# EAGLE design Modified-Pro-Mini (EAGLE 8.3.2)
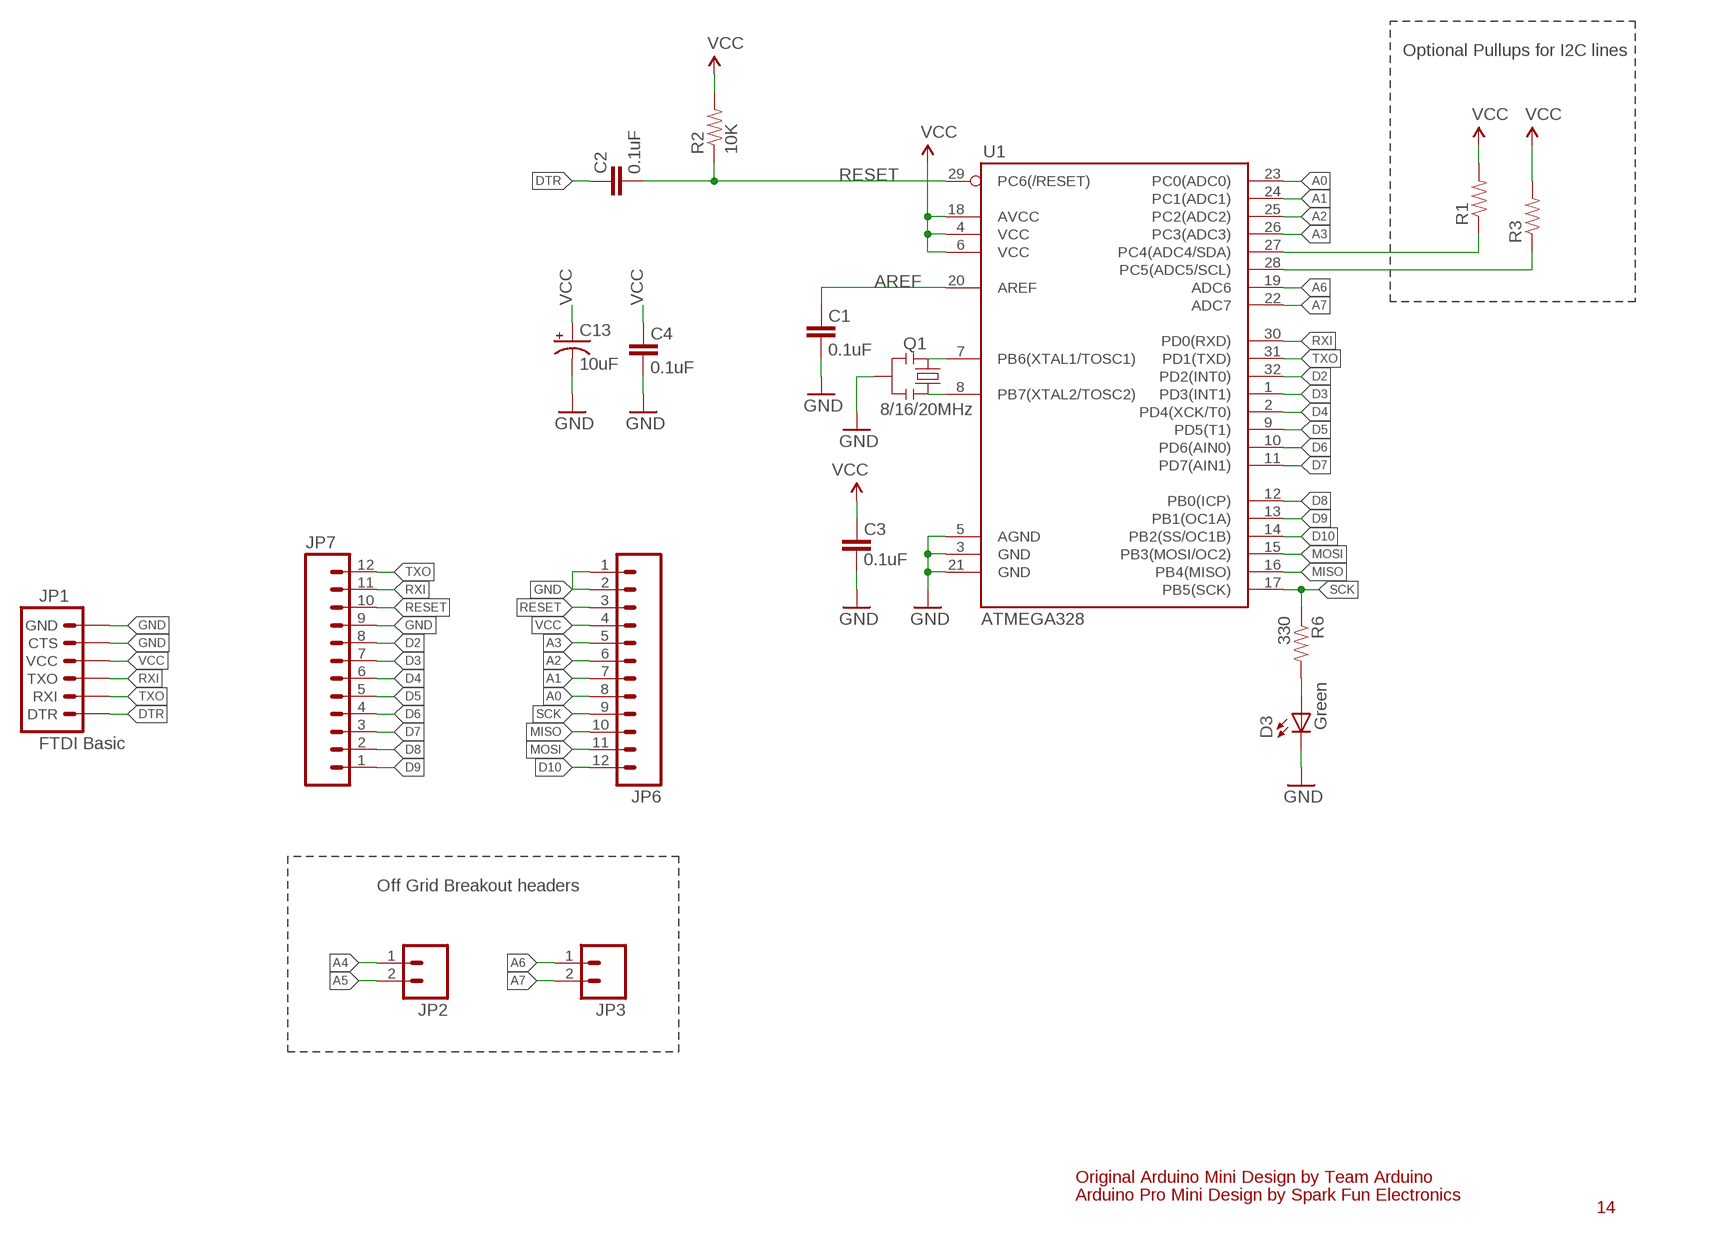
[diagram p0: schematic, sheet 1]

## Parts
C1  0.1uF  CAP0603-CAP  [0603-CAP]
C2  0.1uF  CAP0603-CAP  [0603-CAP]
C3  0.1uF  CAP0603-CAP  [0603-CAP]
C4  0.1uF  CAP0603-CAP  [0603-CAP]
C13  10uF  CAP_POL1206  [EIA3216]
D3  Green  LED  [0603-LED-ALT1]
JP1  FTDI Basic  ARDUINO_SERIAL_PROGRAMPTH  [1X06]
JP2  M02PTH  [1X02]
JP3  M02PTH  [1X02]
JP6  M12PTH  [1X12]
JP7  M12PTH  [1X12]
Q1  8/16/20MHz  RESONATOR1:1  [RESONATOR-SMD-1:1]
R1  RESISTOR0603-RES  [0603-RES]
R2  10K  RESISTOR0603-RES  [0603-RES]
R3  RESISTOR0603-RES  [0603-RES]
R6  330  RESISTOR0603-RES  [0603-RES]
U1  ATMEGA328  ATMEGA168  [TQFP32-08]

## Nets
A0: JP6.8 U1.23(PC0(ADC0))
A1: JP6.7 U1.24(PC1(ADC1))
A2: JP6.6 U1.25(PC2(ADC2))
A3: JP6.5 U1.26(PC3(ADC3))
A4: JP2.1 R1.1 U1.27(PC4(ADC4/SDA))
A5: JP2.2 R3.1 U1.28(PC5(ADC5/SCL))
A6: JP3.1 U1.19(ADC6)
A7: JP3.2 U1.22(ADC7)
AREF: C1.2 U1.20(AREF)
D2: JP7.8 U1.32(PD2(INT0))
D3: JP7.7 U1.1(PD3(INT1))
D4: JP7.6 U1.2(PD4(XCK/T0))
D5: JP7.5 U1.9(PD5(T1))
D6: JP7.4 U1.10(PD6(AIN0))
D7: JP7.3 U1.11(PD7(AIN1))
D8: JP7.2 U1.12(PB0(ICP))
D9: JP7.1 U1.13(PB1(OC1A))
D10: JP6.12 U1.14(PB2(SS/OC1B))
DTR: C2.2 JP1.1(DTR)
GND [vcc]: C1.1 C3.1 C4.1 C13.C(-) D3.C JP1.5(CTS) JP1.6(GND) JP6.1 JP6.2 JP7.9 Q1.2 U1.3(GND) U1.5(AGND) U1.21(GND)
MISO: JP6.10 U1.16(PB4(MISO))
MOSI: JP6.11 U1.15(PB3(MOSI/OC2))
N$1: Q1.3 U1.8(PB7(XTAL2/TOSC2))
N$2: Q1.1 U1.7(PB6(XTAL1/TOSC1))
N$7: D3.A R6.2
RESET: C2.1 JP6.3 JP7.10 R2.1 U1.29(PC6(/RESET))
RXI: JP1.3(TXO) JP7.11 U1.30(PD0(RXD))
SCK: JP6.9 R6.1 U1.17(PB5(SCK))
TXO: JP1.2(RXI) JP7.12 U1.31(PD1(TXD))
VCC: C3.2 C4.2 C13.A(+) JP1.4(VCC) JP6.4 R1.2 R2.2 R3.2 U1.4(VCC) U1.6(VCC) U1.18(AVCC)

## Notes on the sheet
- Optional Pullups for I2C lines
- Off Grid Breakout headers
- Original Arduino Mini Design by Team Arduino
- Arduino Pro Mini Design by Spark Fun Electronics
- 14

## Library data of the parts
C1-C4 = SparkFun:CAP: Capacitor Standard 0603 ceramic capacitor, and 0.1" leaded capacitor.
C13 = SparkFun:CAP_POL: Capacitor Polarized These are standard SMD and PTH capacitors. Normally 10uF, 47uF, and 100uF in electrolytic and tantalum varieties. Always verify the external diameter of the through hole cap, it varies with capacity, voltage, and manufacturer. The EIA devices should be standard.
D3 = Testing:LED: LEDs Standard schematic elements and footprints for 5mm, 3mm, 1206, and 0603 sized LEDs. 5mm - Spark Fun Electronics SKU : COM-00529 (and others)
JP1 = SparkFun:ARDUINO_SERIAL_PROGRAM
JP2 JP3 = SparkFun:M02: Header 2 Standard 2-pin 0.1" header. Use with straight break away headers (SKU : PRT-00116), right angle break away headers (PRT-00553), swiss pins (PRT-00743), machine pins (PRT-00117), and female headers (PRT-00115). Molex polarized connector foot print use with SKU : PRT-08233 with associated crimp pins and housings.
JP6 JP7 = SparkFun:M12: Header 12 Standard 12-pin 0.1" header. Use with straight break away headers (SKU : PRT-00116), right angle break away headers (PRT-00553), swiss pins (PRT-00743), machine pins (PRT-00117), and female headers (PRT-00115).
Q1 = Testing:RESONATOR: Resonator Small SMD resonator. This is the itty bitty 10/20MHz resonators with built in caps. CSTCE10M0G55 and CSTCE20M0V53. Footprint for SMD has been used in SFE production for years, and does work okay. 1:1 is an attempt to get larger fillets on the sides so it will be easier to inspect these solders in our AOI machine. The pads have been minimized to match the actual metal under the resonator. To see this relation, it includes an image import of the bottom side of the component. Imported to scale on layer 200.
R1-R3 R6 = SparkFun:RESISTOR: Resistor Basic schematic elements and footprints for 0603, 1206, and PTH resistors.
U1 = SparkFun:ATMEGA168

## Net classes
0 default: width 0.203 mm
1 vcc: width 0.254 mm

## Board
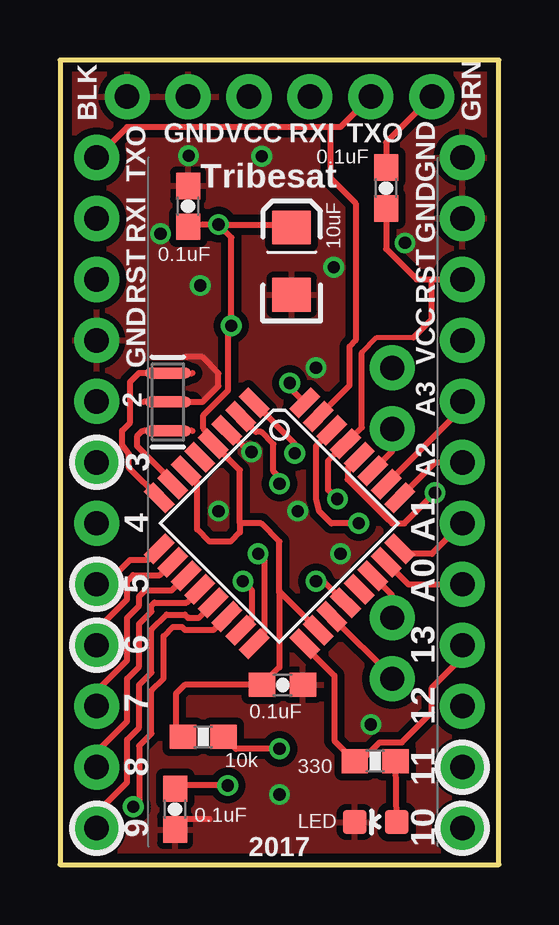
[diagram p1: board, top side]
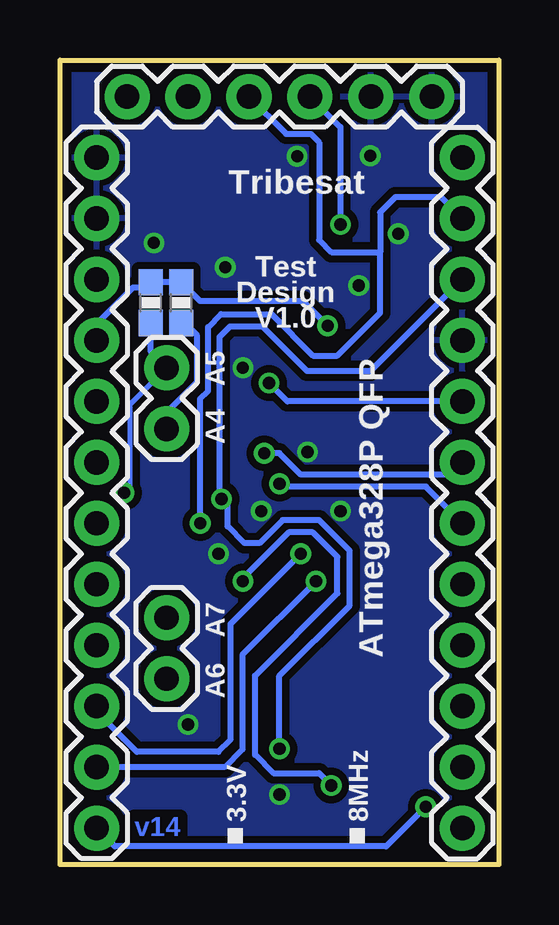
[diagram p2: board, bottom side, seen from below]

Size 18.29 x 33.53 mm. Coordinates in mm from the lower left corner, seen from the top.
Outline: 0,33.53 0,0 18.29,0 18.29,33.53 0,33.53
Copper layers (1*16): Top 0.0356mm / dielectric 1.5011mm / Bottom 0.0356mm
Design rules "oshpark-2layer": minimum track width 6mil, minimum drill 13mil, track to track 6mil, track to pad 6mil, pad to pad 6mil, via to via 6mil, smd to smd 6mil, copper to edge 15mil, drill to drill 6mil, minimum pad ring 7mil, minimum via ring 7mil, stop-mask expansion 2.5mil, vias tented up to drill 0mil, thermal gap 10mil

### Footprints (pad centres in the part's own frame; a part is rotated, then mirrored left to right if it is on the bottom)
0603-CAP = smd 1.1 x 1: 1 -0.85,0; 2 0.85,0
EIA3216 = smd 1.4 x 1.6: A 1.4,0; C -1.4,0
0603-LED-ALT1 = smd 1 x 1: A 0,-0.877; C 0,0.877
1X06 = drill 1.016 pad 1.88: 1 0,0; 2 2.54,0; 3 5.08,0; 4 7.62,0; 5 10.16,0; 6 12.7,0
1X02 = drill 1.016 pad 1.88: 1 0,0; 2 2.54,0
1X12 = drill 1.016 pad 1.88: 1 0,0; 2 2.54,0; 3 5.08,0; 4 7.62,0; 5 10.16,0; 6 12.7,0; 7 15.24,0; 8 17.78,0; 9 20.32,0; 10 22.86,0; 11 25.4,0; 12 27.94,0
RESONATOR-SMD-1:1 = smd 0.45 x 1.905: 1 -1.2,0; 2 0,0; 3 1.2,0
0603-RES = smd 1.1 x 1: 1 -0.85,0; 2 0.85,0
TQFP32-08 = smd 1.27 x 0.559: 1 -4.293,2.8; 2 -4.293,2; 3 -4.293,1.2; 4 -4.293,0.4; 5 -4.293,-0.4; 6 -4.293,-1.2; 7 -4.293,-2; 8 -4.293,-2.8; 17 4.293,-2.8; 18 4.293,-2; 19 4.293,-1.2; 20 4.293,-0.4; 21 4.293,0.4; 22 4.293,1.2; 23 4.293,2; 24 4.293,2.8 | smd 0.559 x 1.27: 9 -2.8,-4.293; 10 -2,-4.293; 11 -1.2,-4.293; 12 -0.4,-4.293; 13 0.4,-4.293; 14 1.2,-4.293; 15 2,-4.293; 16 2.8,-4.293; 25 2.8,4.293; 26 2,4.293; 27 1.2,4.293; 28 0.4,4.293; 29 -0.4,4.293; 30 -1.2,4.293; 31 -2,4.293; 32 -2.8,4.293

### Placement (x,y rotation side)
C1  4.8,2.31 90 top
C2  13.59,28.19 90 top
C3  9.27,7.49 180 top
C4  5.33,27.43 270 top
C13  9.65,25.15 90 top
D3  13.16,1.78 90 top
JP1  15.49,32 0 bottom
JP2  13.84,18.16 90 bottom
JP3  13.84,7.75 90 bottom
JP6  16.76,29.46 270 bottom
JP7  1.52,1.52 90 bottom
Q1  4.5,19.28 90 top
R1  13.23,23.42 90 bottom
R2  5.97,5.33 180 top
R3  14.5,23.42 90 bottom
R6  13.13,4.32 0 top
U1  9.14,14.22 315 top

### Tracks (layer width: path | path; a pad name or v marks a point on that pad's centre or on a via)
A0
  Top 0.254: 14.51,11.68 JP6.8 | U1.23 14.51,11.68 | 14.51,11.68
A1
  Top 0.254: JP6.7 15.49,12.95 14.22,12.95 14.16,13.02 U1.24
A2
  Top 0.254: U1.25 15.64,16.76 JP6.6
A3
  Top 0.254: 16.76,19.02 JP6.5 16.76,19.02 | U1.26 16.76,19.02
A4
  Top 0.254: 13.84,17.23 JP2.1 | U1.27 13.84,17.23 | 13.84,17.23
  Bottom 0.254: JP2.1 13.84,18.85 12.57,20.12 12.57,22.06 13.23,22.72 | R1.1 13.23,22.72 | 13.23,22.72 13.28,22.77
A5  (via drill 0.51)
  Top 0.254: v15.62,15.49 14.35,14.22 13.84,14.22 13.72,14.35 13.69,14.35 11.99,16.05 11.99,16.5 U1.28 | U1.28
  Bottom 0.203: v15.62,15.49 15.37,15.75 15.37,19.18 JP2.2
  Bottom 0.254: R3.1 14.5,21.36 JP2.2
A6
  Top 0.254: U1.19 13.84,7.83 JP3.1
A7
  Top 0.254: U1.22 13.84,11.22 JP3.2 | U1.22
AREF  (via drill 0.51)
  Top 0.254: 10.99,11.81 v10.67,11.81 10.99,11.81 | v6.98,3.3 4.94,3.3 C1.2 | U1.20 10.99,11.81
  Bottom 0.254: v10.67,11.81 10.67,11.94 8.76,13.84 7.75,13.84 6.73,12.83 6.73,11.3 10.16,7.87 10.16,4.57 9.4,3.81 7.49,3.81 v6.98,3.3
D2  (via drill 0.51)
  Top 0.254: U1.32 9.58,19.86 v9.58,20.07
  Bottom 0.254: JP7.8 8.81,19.3 v9.58,20.07
D3  (via drill 0.51)
  Top 0.254: 9.78,17.55 v9.78,17.14 9.78,17.55 | U1.1 9.78,17.55
  Bottom 0.254: JP7.7 2.03,16.26 8.25,16.26 9.14,17.14 v9.78,17.14
D4  (via drill 0.51)
  Top 0.254: v9.14,15.88 9.4,15.88 8.89,16.38 8.89,17.53 8.38,18.03 8.16,18.03 | U1.2 8.16,18.03 | 8.16,18.03
  Bottom 0.254: JP7.6 3.05,15.75 9.02,15.75 v9.14,15.88
D5
  Top 0.254: U1.9 3.66,12.7 2.92,12.7 1.91,11.68 JP7.5
D6
  Top 0.254: 1.52,9.43 JP7.4 1.52,9.78 2.79,11.05 2.79,11.81 3.05,12.06 4.16,12.06 | U1.10 4.16,12.06 | 4.16,12.06
D7
  Top 0.254: JP7.3 1.52,7.24 2.79,8.51 2.79,10.29 3.3,10.79 3.3,11.18 3.56,11.43 4.65,11.43 U1.11 | U1.11
D8
  Top 0.254: JP7.2 1.52,4.7 2.79,5.97 2.79,7.75 3.3,8.25 3.3,10.03 3.81,10.54 3.81,10.79 3.94,10.92 5.28,10.92 U1.12 | U1.12
D9
  Top 0.254: JP7.1 1.52,2.16 2.79,3.43 2.79,5.21 3.3,5.71 3.3,7.49 3.81,8 3.81,9.78 4.45,10.41 5.21,10.41 5.33,10.29 5.77,10.29 U1.13 | U1.13
D10  (via drill 0.51)
  Top 0.254: v3.05,2.41 3.3,2.67 3.3,4.95 3.81,5.46 3.81,7.24 4.32,7.75 4.32,9.53 4.7,9.91 5.08,9.91 5.21,9.78 6.4,9.78 U1.14 | U1.14
  Bottom 0.254: JP6.12 16,0.76 4.7,0.76 v3.05,2.41
DTR
  Top 0.254: C2.2 13.59,30.1 JP1.1
GND  (via drill 0.51)
  Top 0.254: C1.1 5.24,1.91 6.22,1.91 | U1.3 7.92,17.14 8,17.14 | 5.51,19.28 5.94,19.28 6.6,19.94 6.6,20.47 5.92,21.16 5.28,21.16 5.26,21.18
  other vias: 11.68,12.95 9.91,14.73 9.14,2.92 5.36,29.54 10.67,20.7 6.6,14.73 14.38,25.91 7.98,17.2 4.19,26.29 11.4,24.89 8.41,29.51 5.84,24.13 12.95,5.84
  pour Top (isolate 0.305): 0.25,33.27 18.03,33.27 18.03,0.25 0.25,0.25
  pour Bottom (isolate 0.305): 0.25,33.27 18.03,33.27 18.03,0.25 0.25,0.25
MISO  (via drill 0.51)
  Top 0.254: U1.16 8.51,9.63 8.51,12.7 v8.25,12.95
  Bottom 0.254: v8.25,12.95 11.18,10.03 11.18,5.21 11.68,4.7 15.09,4.7 16.76,6.38 JP6.10
MOSI  (via drill 0.51)
  Top 0.254: v7.62,11.81 8,11.43 8,10.25 U1.15 | U1.15
  Bottom 0.254: v7.62,11.81 10.69,8.74 10.69,4.8 11.43,4.06 JP6.11
N$1
  Top 0.254: U1.8 2.87,16.54 2.87,17.12 2.59,17.48 2.59,18.09 2.92,18.42 2.92,20.12 3.28,20.48 3.48,20.48
N$2
  Top 0.254: 4.42,16.12 U1.7 4.69,15.96 3.2,17.45 3.2,17.85 3.43,18.08 3.48,18.08
N$7
  Top 0.254: D3.A R6.2
RESET  (via drill 0.51)
  Top 0.203: 14.73,21.97 13.21,21.97 12.57,21.34
  Top 0.254: 15.49,24.38 JP6.3 | 12.57,21.34 12.57,18.22 U1.29 | 15.49,24.38 15.49,22.73 14.73,21.97 | v11.56,15.24 11.18,15.62 11.18,16.82 U1.29 | U1.29 | C2.1 13.59,25.65 14.86,24.38 15.49,24.38 | v9.14,4.83 7.33,4.83 R2.1
  Bottom 0.254: v9.14,4.83 9.14,7.87 6.22,10.79 6.22,13.08 7.49,14.35 9.02,14.35 9.97,13.4 10.61,13.4 11.3,14.1 11.3,14.99 v11.56,15.24 11.63,15.32 11.63,22 11.2,22.43 9.86,22.43 8,20.57 5.33,20.57 JP7.10
RXI  (via drill 0.51)
  Top 0.254: v12.45,14.22 11.3,14.22 10.79,14.73 10.67,15.24 10.67,17.45 U1.30 | U1.30
  Bottom 0.254: v12.45,14.22 12.45,19.41 12.12,19.74 12.12,22.4 11.58,22.94 9.47,22.94 7.75,21.21 6.73,21.21 4.95,22.99 4.95,25.53 | JP7.11 2.41,27.81 4.32,27.81 4.95,27.18 4.95,25.53 | 4.95,25.53 6.98,25.53 7.49,26.04 7.49,30.1 7.85,30.46 8.87,30.46 JP1.3
SCK
  Top 0.254: JP6.9 16.76,8.64 15.49,7.37 15.49,6.35 14.24,5.1 13.32,5.1 12.54,4.32 | 12.19,4.41 R6.1 | R6.1 12.54,4.32 | U1.17 10.2,9.11 11.43,7.87 11.43,5.17 R6.1 | R6.1 12.54,4.32
TXO
  Top 0.254: JP7.12 2.79,30.73 11.28,30.73 | 11.28,30.73 11.68,30.73 JP1.2 | 12.06,19.97 12.06,21.59 12.32,21.84 12.32,27.56 11.28,28.6 11.28,30.73 | U1.31 12.06,19.97 | 12.06,19.97
VCC  (via drill 0.51)
  Top 0.254: 9.14,11.4 9.19,11.35 9.14,11.3 | 9.14,11.3 9.14,11.4 | 9.14,11.4 9.14,13.46 8.38,14.22 7.49,14.22 | 7.49,14.22 7.49,13.84 7.11,13.46 6.22,13.46 5.71,13.97 5.71,15.96 U1.6 | 7.49,14.22 7.49,16.44 U1.4 | 9.14,11.3 9.14,8.22 C3.2 5.21,7.49 4.83,7.11 4.83,5.63 R2.2 | U1.4 | U1.18 9.14,11.4 | 6.39,17.57 U1.4 | U1.4 6.39,17.75 5.97,18.17 5.97,18.73 7.01,19.77 7.01,22.33 v7.14,22.45 7.14,26.14 v6.6,26.67 | v6.6,26.67 6.88,26.39 | v6.6,26.67 5.93,26.67 C4.2 | v6.6,26.67 9.53,26.67 C13.A
  Bottom 0.254: JP6.4 16.76,22.53 15.24,24.05 14.72,24.05 R3.2 R1.2 12.46,23.5 8.18,23.5 v7.14,22.45 | v6.6,26.67 6.6,30.73 JP1.4

### Text on the board
Bottom: v14
tPlace: BLK | GRN | GND | VCC | RXI | TXO | 0.1uF | TXO | Tribesat | GND | RXI | GND | 0.1uF | 10uF | RST | RST | VCC | GND | 2 | A3 | 3 | A2 | 4 | A1 | 5 | A0 | 6 | 13 | 7 | 0.1uF | 12 | 10k | 330 | 8 | 11 | 0.1uF | 9 | 2017 | LED | 10
bPlace: Tribesat | Test / Design / V1.0 | ATmega328P QFP | A5 | A4 | A7 | A6 | 8MHz | 3.3V
tValues: Valid combinations: | 168V / 3.3V Reg / 8MHz | 168 / 5V Reg / 16MHz | 168 / 5V Reg / 20MHz | Mark back accordingly | Arduino Pro Mini